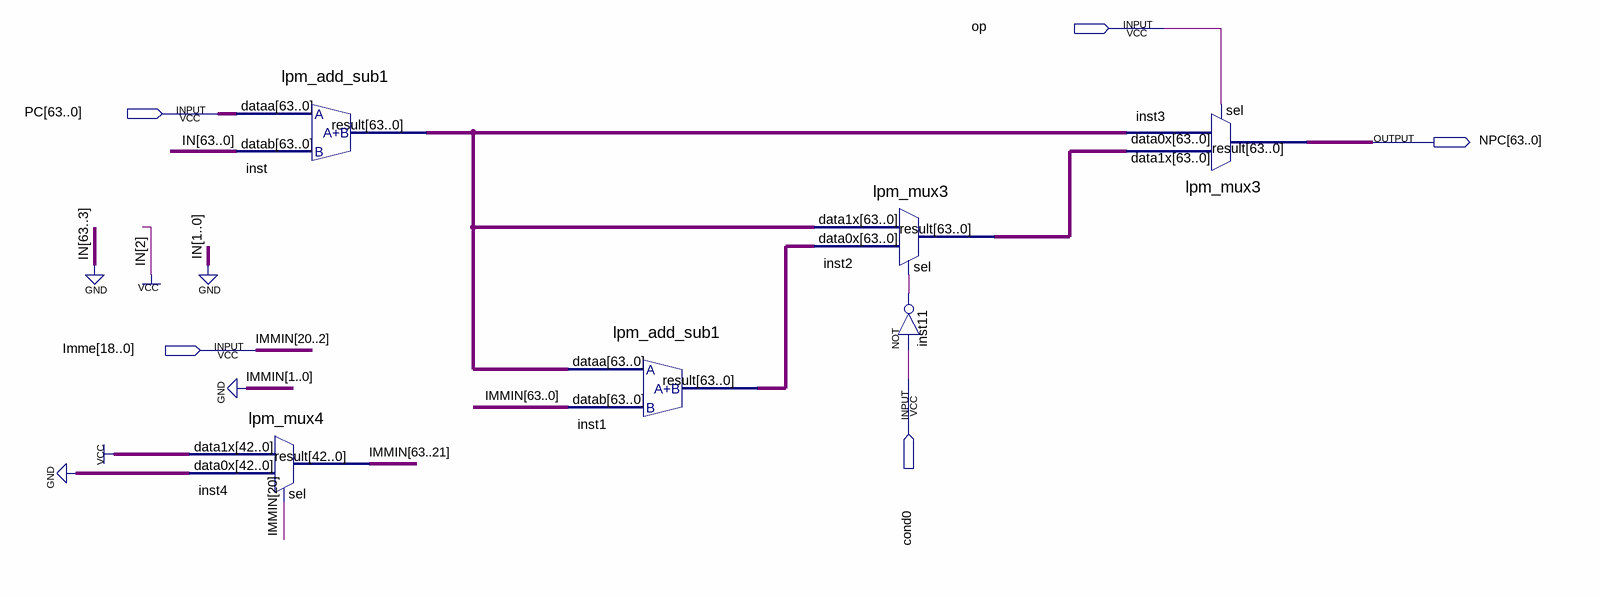
[diagram p0: schematic sheet]
// Quartus schematic ACU.bdf as structural Verilog: 6 symbols, 5 pins
module ACU (
  input  op,
  input  [63:0] PC,
  input  [18:0] Imme,
  input  cond0,
  output [63:0] NPC
);

  wire inst11_out;
  wire [63:0] inst1_result, inst2_result, inst_result;
  wire [63:21] IMMIN;

  lpm_add_sub1 inst (
    .dataa(PC), .datab(64'b0000000000000000000000000000000000000000000000000000000000000100),
    .result(inst_result));
  lpm_mux4 inst4 (.data1x({43{1'b1}}), .data0x({43{1'b0}}), .sel(Imme[18]), .result(IMMIN));
  lpm_add_sub1 inst1 (.dataa(inst_result), .datab({IMMIN, Imme, 2'b00}), .result(inst1_result));
  lpm_mux3 inst2 (.data1x(inst_result), .data0x(inst1_result), .sel(inst11_out), .result(inst2_result));
  not inst11 (inst11_out, cond0);
  lpm_mux3 inst3 (.data1x(inst2_result), .data0x(inst_result), .sel(op), .result(NPC));

  // Other names for the same wires on the sheet: IMMIN[20:2] = Imme
endmodule
